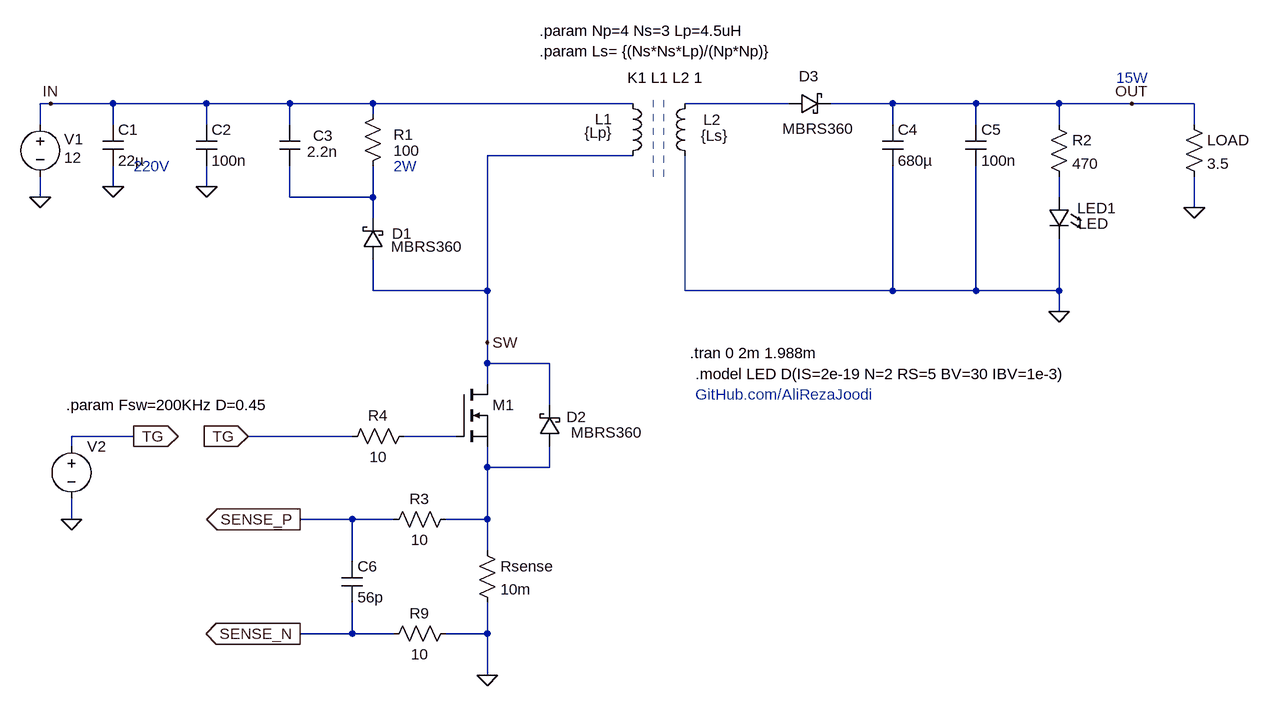
[diagram p0: schematic v1.0.asc]
v1.0.asc, the LTspice schematic file:
Version 4.1
SHEET 1 4292 1972
WIRE 1824 -2128 1808 -2128
WIRE 1920 -2128 1824 -2128
WIRE 2064 -2128 1920 -2128
WIRE 2192 -2128 2064 -2128
WIRE 2320 -2128 2192 -2128
WIRE 2720 -2128 2320 -2128
WIRE 2960 -2128 2800 -2128
WIRE 3120 -2128 3024 -2128
WIRE 3248 -2128 3120 -2128
WIRE 3376 -2128 3248 -2128
WIRE 3488 -2128 3376 -2128
WIRE 3584 -2128 3488 -2128
WIRE 2320 -2112 2320 -2128
WIRE 1808 -2096 1808 -2128
WIRE 1920 -2096 1920 -2128
WIRE 2064 -2096 2064 -2128
WIRE 2192 -2096 2192 -2128
WIRE 3120 -2096 3120 -2128
WIRE 3248 -2096 3248 -2128
WIRE 3376 -2096 3376 -2128
WIRE 3584 -2096 3584 -2128
WIRE 2720 -2048 2496 -2048
WIRE 1920 -2000 1920 -2032
WIRE 2064 -2000 2064 -2032
WIRE 1808 -1984 1808 -2016
WIRE 2192 -1984 2192 -2032
WIRE 2320 -1984 2320 -2032
WIRE 2320 -1984 2192 -1984
WIRE 3376 -1984 3376 -2016
WIRE 3584 -1968 3584 -2016
WIRE 2320 -1952 2320 -1984
WIRE 2320 -1840 2320 -1888
WIRE 2496 -1840 2496 -2048
WIRE 2496 -1840 2320 -1840
WIRE 2800 -1840 2800 -2048
WIRE 3120 -1840 3120 -2032
WIRE 3120 -1840 2800 -1840
WIRE 3248 -1840 3248 -2032
WIRE 3248 -1840 3120 -1840
WIRE 3376 -1840 3376 -1920
WIRE 3376 -1840 3248 -1840
WIRE 3376 -1808 3376 -1840
WIRE 2496 -1760 2496 -1840
WIRE 2496 -1728 2496 -1760
WIRE 2592 -1728 2496 -1728
WIRE 2496 -1696 2496 -1728
WIRE 2592 -1664 2592 -1728
WIRE 1952 -1616 1856 -1616
WIRE 2288 -1616 2128 -1616
WIRE 2448 -1616 2368 -1616
WIRE 1856 -1600 1856 -1616
WIRE 2496 -1568 2496 -1600
WIRE 2592 -1568 2592 -1600
WIRE 2592 -1568 2496 -1568
WIRE 1856 -1488 1856 -1520
WIRE 2288 -1488 2208 -1488
WIRE 2352 -1488 2288 -1488
WIRE 2496 -1488 2496 -1568
WIRE 2496 -1488 2432 -1488
WIRE 2496 -1440 2496 -1488
WIRE 2288 -1424 2288 -1488
WIRE 2288 -1312 2288 -1360
WIRE 2288 -1312 2208 -1312
WIRE 2352 -1312 2288 -1312
WIRE 2496 -1312 2496 -1360
WIRE 2496 -1312 2432 -1312
WIRE 2496 -1248 2496 -1312
FLAG 2208 -1488 SENSE_P
IOPIN 2208 -1488 Out
FLAG 2208 -1312 SENSE_N
IOPIN 2208 -1312 Out
FLAG 1808 -1984 0
FLAG 2496 -1248 0
FLAG 2064 -2000 0
FLAG 1824 -2128 IN
FLAG 1920 -2000 0
FLAG 3488 -2128 OUT
FLAG 3584 -1968 0
FLAG 2496 -1760 SW
FLAG 2128 -1616 TG
IOPIN 2128 -1616 In
FLAG 3376 -1808 0
FLAG 1856 -1488 0
FLAG 1952 -1616 TG
IOPIN 1952 -1616 Out
SYMBOL res 2480 -1456 R0
SYMATTR InstName Rsense
SYMATTR Value 10m
SYMBOL voltage 1808 -2112 R0
WINDOW 123 0 0 Left 0
WINDOW 39 24 105 Left 2
WINDOW 0 37 39 Left 2
WINDOW 3 37 67 Left 2
SYMATTR InstName V1
SYMATTR Value 12
SYMBOL ind 2704 -2144 R0
WINDOW 0 -15 40 Right 2
WINDOW 3 -15 61 Right 2
SYMATTR InstName L1
SYMATTR Value {Lp}
SYMATTR SpiceLine Rser=0.010
SYMATTR Type ind
SYMBOL cap 2176 -2032 M180
WINDOW 0 52 47 Left 2
WINDOW 3 43 22 Left 2
SYMATTR InstName C3
SYMATTR Value 2.2n
SYMATTR SpiceLine Rser=1m
SYMBOL res 2304 -2016 M180
WINDOW 0 48 64 Left 2
WINDOW 3 48 40 Left 2
SYMATTR InstName R1
SYMATTR Value 100
SYMATTR SpiceLine pwr=2
SYMBOL nmos 2448 -1696 R0
WINDOW 3 56 72 Invisible 2
SYMATTR Value BSC100N06LS3
SYMATTR InstName M1
SYMBOL schottky 2336 -1888 R180
WINDOW 0 -44 40 Left 2
WINDOW 3 -12 20 Right 2
SYMATTR InstName D1
SYMATTR Value MBRS360
SYMBOL cap 2048 -2096 R0
SYMATTR InstName C2
SYMATTR Value 100n
SYMBOL schottky 2608 -1600 R180
WINDOW 0 -41 46 Left 2
WINDOW 3 -126 22 Left 2
SYMATTR InstName D2
SYMATTR Value MBRS360
SYMBOL cap 1904 -2096 R0
SYMATTR InstName C1
SYMATTR Value 22µ
SYMBOL ind 2816 -2032 R180
WINDOW 0 -40 71 Left 2
WINDOW 3 -9 47 Right 2
SYMATTR InstName L2
SYMATTR Value {Ls}
SYMATTR SpiceLine Rser=0.011
SYMATTR Type ind
SYMBOL schottky 2960 -2112 R270
WINDOW 0 43 31 VTop 2
WINDOW 3 -7 45 VBottom 2
SYMATTR InstName D3
SYMATTR Value MBRS360
SYMBOL cap 3104 -2096 R0
SYMATTR InstName C4
SYMATTR Value 680µ
SYMBOL cap 3232 -2096 R0
SYMATTR InstName C5
SYMATTR Value 100n
SYMBOL res 3360 -2112 R0
SYMATTR InstName R2
SYMATTR Value 470
SYMBOL LED 3392 -1984 M0
WINDOW 0 -72 17 Left 2
WINDOW 3 -60 41 Left 2
SYMATTR InstName LED1
SYMATTR Value LED
SYMBOL res 3568 -2112 R0
SYMATTR InstName LOAD
SYMATTR Value 3.5
SYMBOL res 2448 -1504 R90
WINDOW 0 0 56 VBottom 2
WINDOW 3 32 56 VTop 2
SYMATTR InstName R3
SYMATTR Value 10
SYMBOL res 2448 -1328 R90
WINDOW 0 0 56 VBottom 2
WINDOW 3 32 56 VTop 2
SYMATTR InstName R9
SYMATTR Value 10
SYMBOL cap 2272 -1424 R0
SYMATTR InstName C6
SYMATTR Value 56p
SYMBOL voltage 1856 -1616 R0
WINDOW 3 41 64 Invisible 2
WINDOW 123 0 0 Left 0
WINDOW 39 0 0 Left 0
SYMATTR Value PULSE(0 12 0 1n 1n {D/Fsw} {1/Fsw})
SYMATTR InstName V2
SYMBOL res 2384 -1632 R90
WINDOW 0 0 56 VBottom 2
WINDOW 3 32 56 VTop 2
SYMATTR InstName R4
SYMATTR Value 10
TEXT 2808 -1744 Left 2 !.tran 0 2m 1.988m
TEXT 2712 -2168 Left 2 !K1 L1 L2 1
TEXT 2816 -1712 Left 2 !.model LED D(IS=2e-19 N=2 RS=5 BV=30 IBV=1e-3)
TEXT 2816 -1680 Left 2 ;GitHub.com/AliRezaJoodi
TEXT 2352 -2032 Left 2 ;2W
TEXT 1952 -2032 Left 2 ;220V
TEXT 1848 -1664 Left 2 !.param Fsw=200KHz D=0.45
TEXT 3464 -2168 Left 2 ;15W
TEXT 2576 -2240 Left 2 !.param Np=4 Ns=3 Lp=4.5uH\n.param Ls= {(Ns*Ns*Lp)/(Np*Np)}
LINE Normal 2768 -2016 2768 -2144 2
LINE Normal 2752 -2016 2752 -2144 2

The netlist it stands for:
* v1.0.asc
Rsense N005 0 10m
V1 IN 0 12
L1 IN SW {Lp} Rser=0.010
C3 N002 IN 2.2n Rser=1m
R1 N002 IN 100 pwr=2
M1 SW N004 N005 N005 BSC100N06LS3
D1 SW N002 MBRS360
C2 IN 0 100n
D2 N005 SW MBRS360
C1 IN 0 22µ
L2 0 N001 {Ls} Rser=0.011
D3 N001 OUT MBRS360
C4 OUT 0 680µ
C5 OUT 0 100n
R2 OUT N003 470
D§LED1 N003 0 LED
R§LOAD OUT 0 3.5
R3 N005 SENSE_P 10
R9 0 SENSE_N 10
C6 SENSE_P SENSE_N 56p
V2 TG 0 PULSE(0 12 0 1n 1n {D/Fsw} {1/Fsw})
R4 N004 TG 10
.model D D
.lib standard.dio
.model NMOS NMOS
.model PMOS PMOS
.lib standard.mos
.tran 0 2m 1.988m
K1 L1 L2 1
.model LED D(IS=2e-19 N=2 RS=5 BV=30 IBV=1e-3)
* GitHub.com/AliRezaJoodi
* 2W
* 220V
.param Fsw=200KHz D=0.45
* 15W
.param Np=4 Ns=3 Lp=4.5uH
.param Ls= {(Ns*Ns*Lp)/(Np*Np)}
.backanno
.end